# Altium project betrusted-kbd-v3.PrjPcb
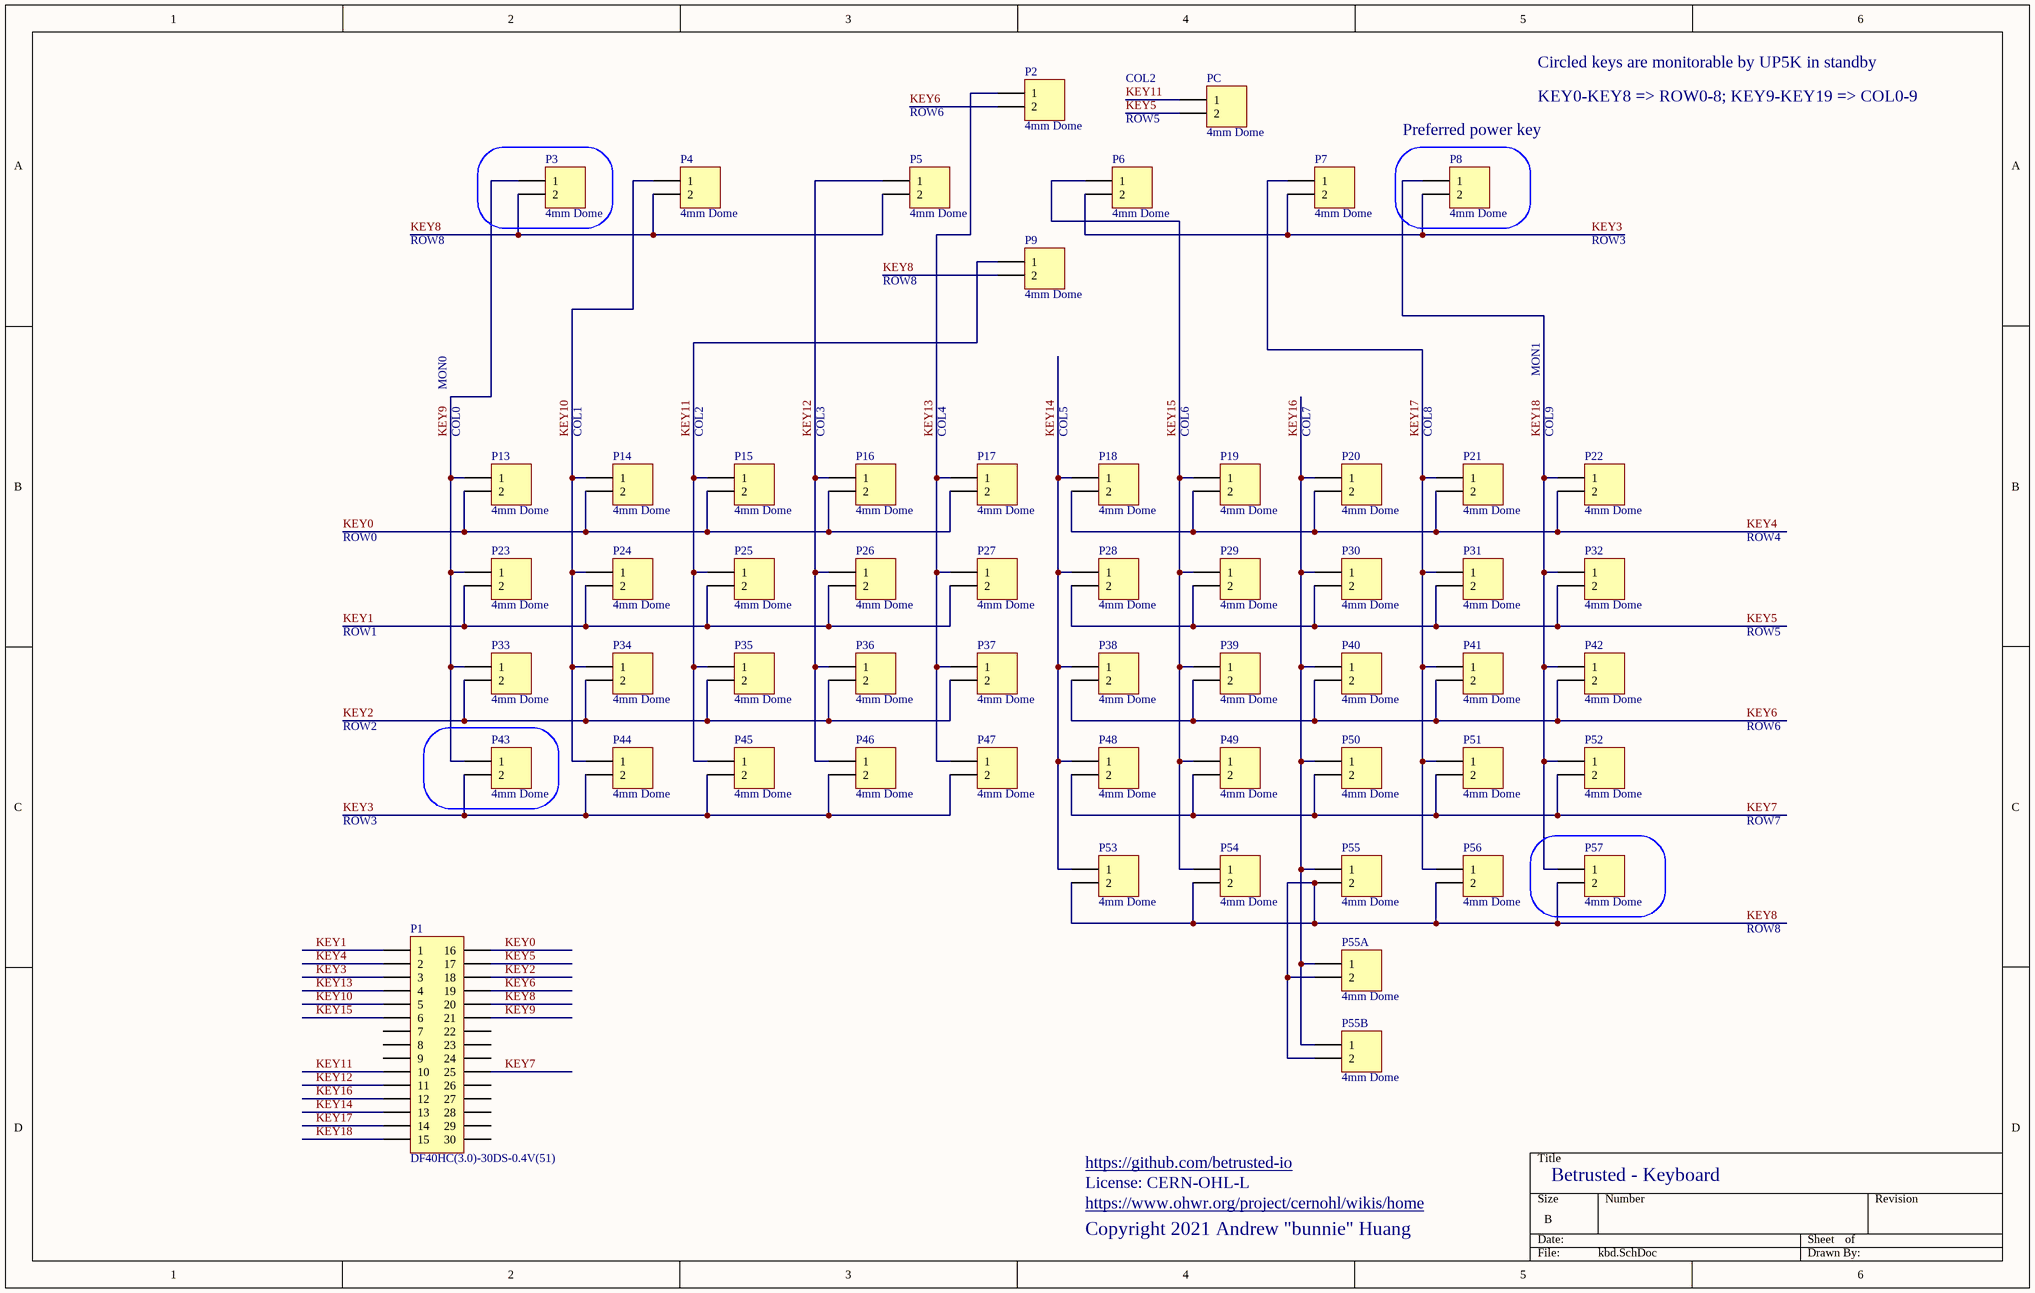
[diagram p0: kbd.SchDoc]
1 sheet, 57 parts. Net scope: global (net labels, ports and power ports of the same name join across sheets).
Board file: bt-kbd-v3a.PcbDoc

## Sheet kbd.SchDoc
size B

### Parts
P1  DF40HC(3.0)-30DS-0.4V(51)  [HRS_DF40HC(3.0)-30DS-0.4V(51)]
P2  4mm Dome  [4MM_DOME_SW]
P3  4mm Dome  [4MM_DOME_SW]
P4  4mm Dome  [4MM_DOME_SW]
P5  4mm Dome  [4MM_DOME_SW]
P6  4mm Dome  [4MM_DOME_SW]
P7  4mm Dome  [4MM_DOME_SW]
P8  4mm Dome  [4MM_DOME_SW]
P9  4mm Dome  [4MM_DOME_SW]
P13  4mm Dome  [4MM_DOME_SW]
P14  4mm Dome  [4MM_DOME_SW]
P15  4mm Dome  [4MM_DOME_SW]
P16  4mm Dome  [4MM_DOME_SW]
P17  4mm Dome  [4MM_DOME_SW]
P18  4mm Dome  [4MM_DOME_SW]
P19  4mm Dome  [4MM_DOME_SW]
P20  4mm Dome  [4MM_DOME_SW]
P21  4mm Dome  [4MM_DOME_SW]
P22  4mm Dome  [4MM_DOME_SW]
P23  4mm Dome  [4MM_DOME_SW]
P24  4mm Dome  [4MM_DOME_SW]
P25  4mm Dome  [4MM_DOME_SW]
P26  4mm Dome  [4MM_DOME_SW]
P27  4mm Dome  [4MM_DOME_SW]
P28  4mm Dome  [4MM_DOME_SW]
P29  4mm Dome  [4MM_DOME_SW]
P30  4mm Dome  [4MM_DOME_SW]
P31  4mm Dome  [4MM_DOME_SW]
P32  4mm Dome  [4MM_DOME_SW]
P33  4mm Dome  [4MM_DOME_SW]
P34  4mm Dome  [4MM_DOME_SW]
P35  4mm Dome  [4MM_DOME_SW]
P36  4mm Dome  [4MM_DOME_SW]
P37  4mm Dome  [4MM_DOME_SW]
P38  4mm Dome  [4MM_DOME_SW]
P39  4mm Dome  [4MM_DOME_SW]
P40  4mm Dome  [4MM_DOME_SW]
P41  4mm Dome  [4MM_DOME_SW]
P42  4mm Dome  [4MM_DOME_SW]
P43  4mm Dome  [4MM_DOME_SW]
P44  4mm Dome  [4MM_DOME_SW]
P45  4mm Dome  [4MM_DOME_SW]
P46  4mm Dome  [4MM_DOME_SW]
P47  4mm Dome  [4MM_DOME_SW]
P48  4mm Dome  [4MM_DOME_SW]
P49  4mm Dome  [4MM_DOME_SW]
P50  4mm Dome  [4MM_DOME_SW]
P51  4mm Dome  [4MM_DOME_SW]
P52  4mm Dome  [4MM_DOME_SW]
P53  4mm Dome  [4MM_DOME_SW]
P54  4mm Dome  [4MM_DOME_SW]
P55  4mm Dome  [4MM_DOME_SW]
P55A  4mm Dome  [4MM_DOME_SW]
P55B  4mm Dome  [4MM_DOME_SW]
P56  4mm Dome  [4MM_DOME_SW]
P57  4mm Dome  [4MM_DOME_SW]
PC  4mm Dome  [4MM_DOME_SW]

### Blocks framed on the sheet
Preferred power key: P8

### Nets
KEY0: P1.16 P13.2 P14.2 P15.2 P16.2 P17.2
KEY1: P1.1 P23.2 P24.2 P25.2 P26.2 P27.2
KEY2: P1.18 P33.2 P34.2 P35.2 P36.2 P37.2
KEY3: P1.3 P6.2 P7.2 P8.2 P43.2 P44.2 P45.2 P46.2 P47.2
KEY4: P1.2 P18.2 P19.2 P20.2 P21.2 P22.2
KEY5: P1.17 P28.2 P29.2 P30.2 P31.2 P32.2 PC.2
KEY6: P1.19 P2.2 P38.2 P39.2 P40.2 P41.2 P42.2
KEY7: P1.25 P48.2 P49.2 P50.2 P51.2 P52.2
KEY8: P1.20 P3.2 P4.2 P5.2 P9.2 P53.2 P54.2 P55.2 P55A.2 P55B.2 P56.2 P57.2
KEY9: P1.21 P3.1 P13.1 P23.1 P33.1 P43.1
KEY10: P1.5 P4.1 P14.1 P24.1 P34.1 P44.1
KEY11: P1.10 P9.1 P15.1 P25.1 P35.1 P45.1 PC.1
KEY12: P1.11 P5.1 P16.1 P26.1 P36.1 P46.1
KEY13: P1.4 P2.1 P17.1 P27.1 P37.1 P47.1
KEY14: P1.13 P18.1 P28.1 P38.1 P48.1 P53.1
KEY15: P1.6 P6.1 P19.1 P29.1 P39.1 P49.1 P54.1
KEY16: P1.12 P20.1 P30.1 P40.1 P50.1 P55.1 P55A.1 P55B.1
KEY17: P1.14 P7.1 P21.1 P31.1 P41.1 P51.1 P56.1
KEY18: P1.15 P8.1 P22.1 P32.1 P42.1 P52.1 P57.1

Not connected (* = marked no-connect by the designer): P1 7 8 9 22 23 24 26 27 28 29 30

### Notes on the sheet
- COL2
- Circled keys are monitorable by UP5K in standby
- KEY0-KEY8 => ROW0-8; KEY9-KEY19 => COL0-9
- ROW6
- ROW5
- ROW8
- ROW3
- MON1
- MON0
- (near P13) COL0
- (near P14) COL1
- (near P15) COL2
- (near P16) COL3
- (near P17) COL4
- (near P18) COL5
- (near P19) COL6
- (near P20) COL7
- (near P21) COL8
- (near P22) COL9
- ROW0
- ROW4
- ROW1
- ROW2
- ROW7
- https://github.com/betrusted-io
- Betrusted - Keyboard
- Copyright 2021 Andrew "bunnie" Huang
- https://www.ohwr.org/project/cernohl/wikis/home
- License: CERN-OHL-L

### Library data of the parts
P1 = Header 15X2A: Header, 15-Pin, Dual row; MYPN: J-DF40HC(3.0)-30DS-0.4V(51); VENDOR: Hirose; System: Connector; LatestRevisionDate: 17-Jul-2002; LatestRevisionNote: Re-released for DXP Platform.; Publisher: Altium Limited; MPN: DF40HC(3.0)-30DS-0.4V(51)
P2-P9 P13-P55 P55A P55B P56 P57 PC = Header 2: Header, 2-Pin; LatestRevisionDate: 17-Jul-2002; LatestRevisionNote: Re-released for DXP Platform.; Publisher: Altium Limited